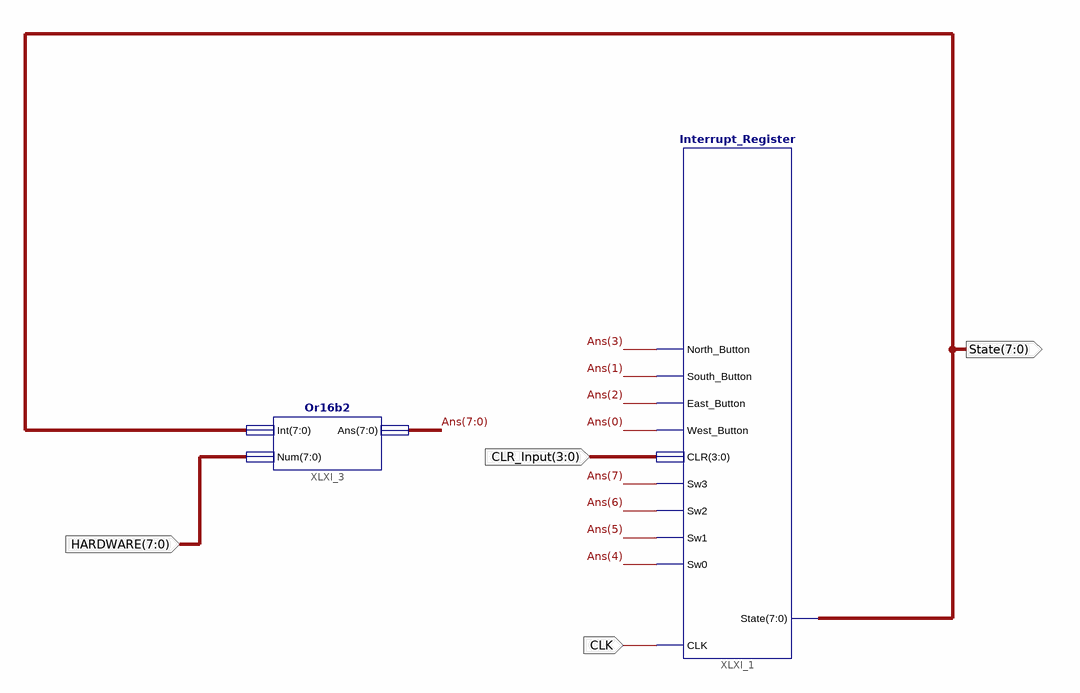
[diagram p0: schematic sheet 1]
// Xilinx ISE schematic Old_and_New_Interrupt.sch (spartan3e) as structural Verilog: 2 symbols, 4 ports
module Old_and_New_Interrupt (
  input  [3:0] CLR_Input,
  input  [7:0] HARDWARE,
  input  CLK,
  output [7:0] State
);

  wire [7:0] Ans;

  Interrupt_Register XLXI_1 (
    .CLR(CLR_Input), .CLK(CLK), .West_Button(Ans[0]), .South_Button(Ans[1]), .East_Button(Ans[2]),
    .Sw1(Ans[5]), .Sw2(Ans[6]), .Sw3(Ans[7]), .North_Button(Ans[3]), .Sw0(Ans[4]), .State(State));
  Or16b2 XLXI_3 (.Int(State), .Num(HARDWARE), .Ans(Ans));
endmodule
